# Altium schematic sheet power.SchDoc
size 584 x 279 mm
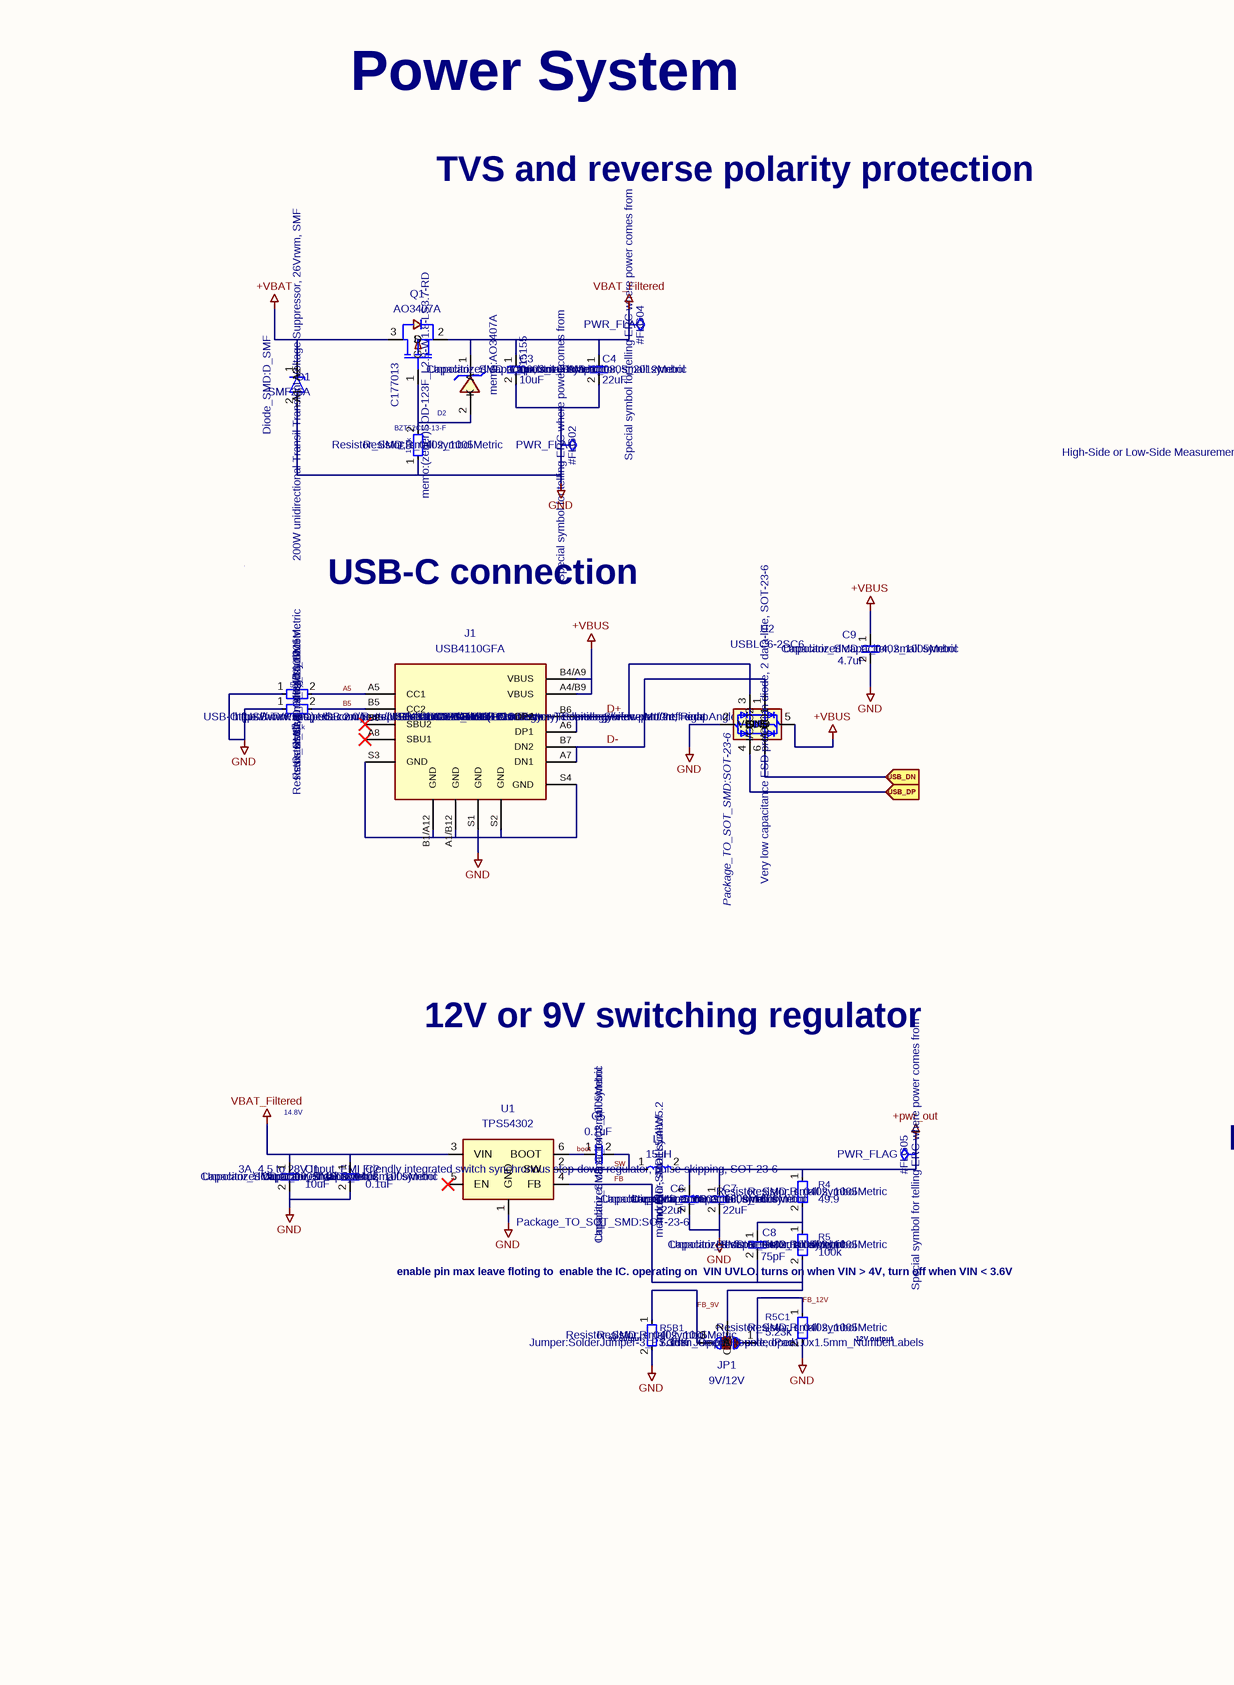
[diagram p0: power.SchDoc, left]
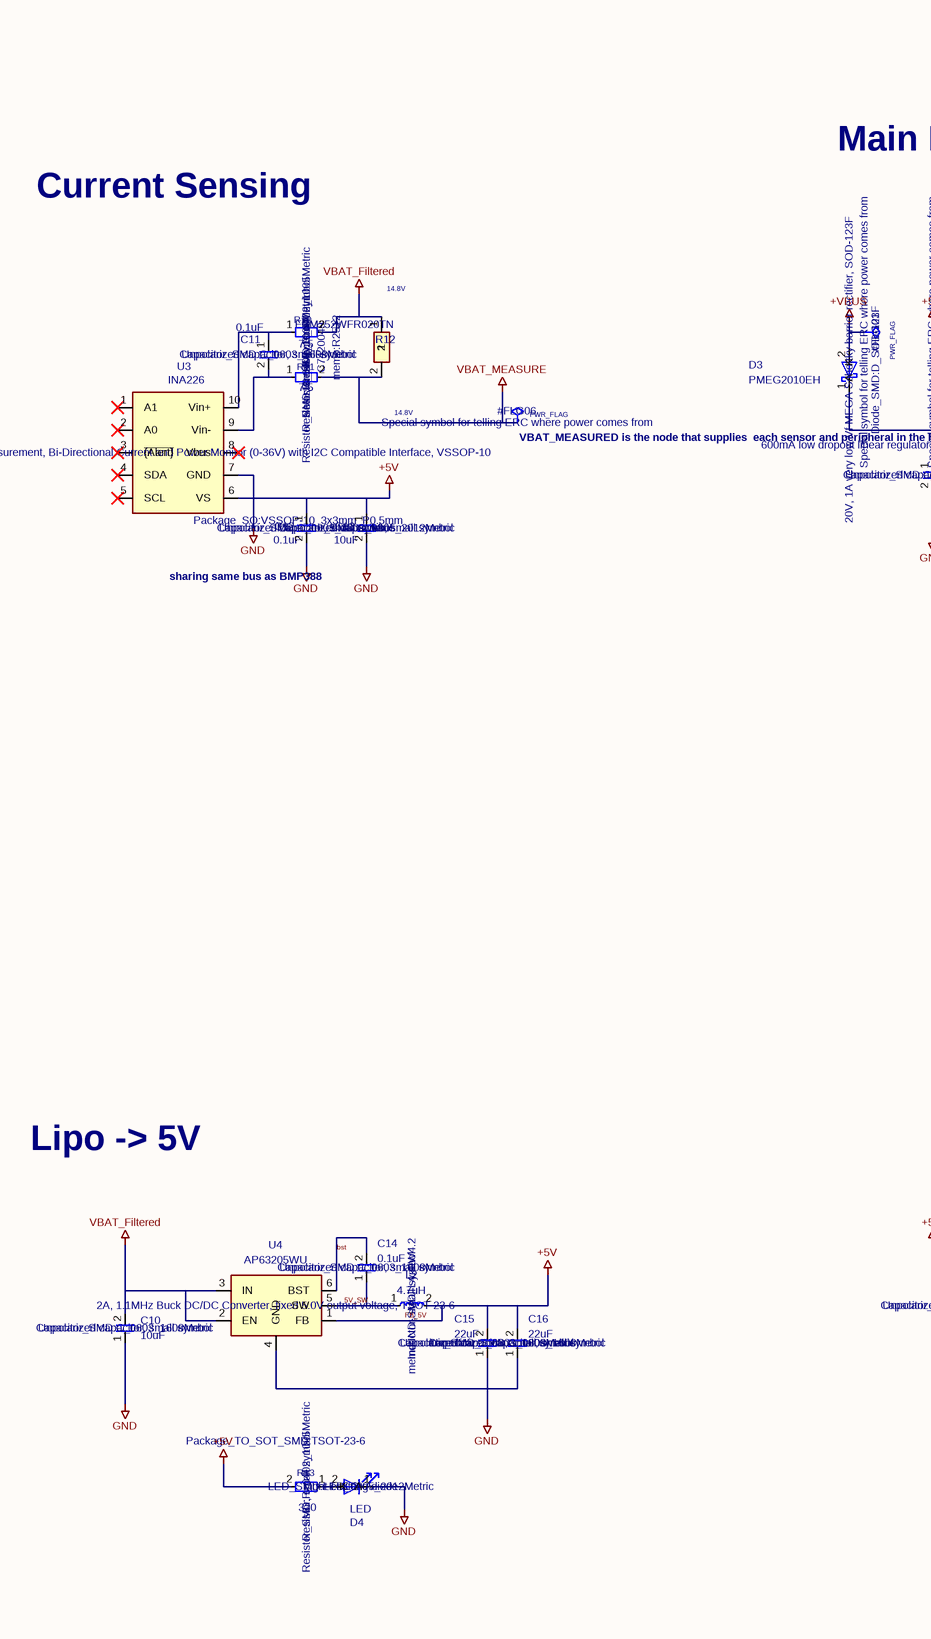
[diagram p1: power.SchDoc, middle]
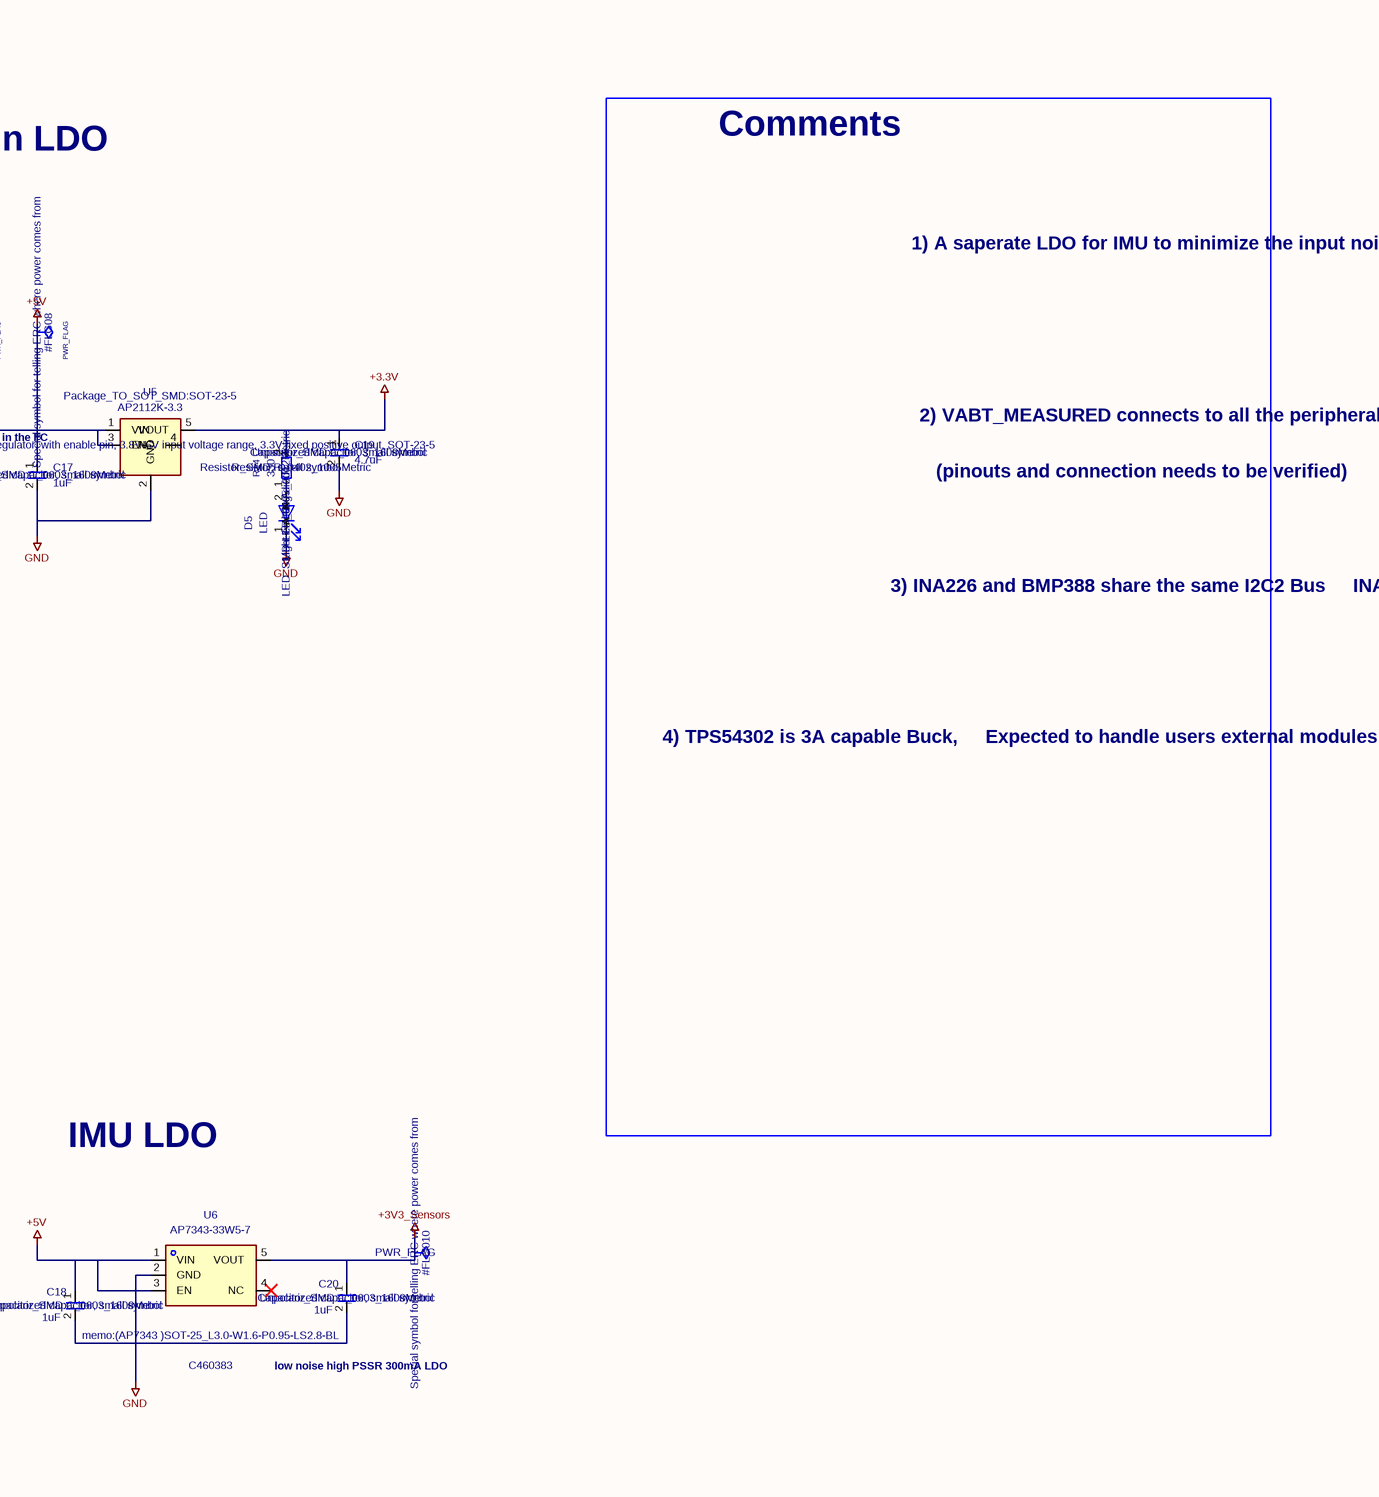
[diagram p2: power.SchDoc, right]

## Parts
#FLG01  Description: Special symbol for telling ERC where power comes from  (hidden comment: PWR_FLAG)  (graphical)
#FLG02  Description: Special symbol for telling ERC where power comes from  (hidden comment: PWR_FLAG)  (graphical)
#FLG04  Description: Special symbol for telling ERC where power comes from  (hidden comment: PWR_FLAG)  (graphical)
#FLG05  Description: Special symbol for telling ERC where power comes from  (hidden comment: PWR_FLAG)  (graphical)
#FLG06  Description: Special symbol for telling ERC where power comes from  (hidden comment: PWR_FLAG)  (graphical)
#FLG08  Description: Special symbol for telling ERC where power comes from  (hidden comment: PWR_FLAG)  (graphical)
#FLG010  Description: Special symbol for telling ERC where power comes from  (hidden comment: PWR_FLAG)  (graphical)
C1  Description: Unpolarized capacitor, small symbol  Footprint: Capacitor_SMD:C_0603_1608Metric  [C_0603_1608Metric]  (hidden comment: 10uF)
C2  Description: Unpolarized capacitor, small symbol  Footprint: Capacitor_SMD:C_0402_1005Metric  [C_0402_1005Metric]  (hidden comment: 0.1uF)
C3  Description: Unpolarized capacitor, small symbol  Footprint: Capacitor_SMD:C_0603_1608Metric  [C_0603_1608Metric]  (hidden comment: 10uF)
C4  Description: Unpolarized capacitor, small symbol  Footprint: Capacitor_SMD:C_0805_2012Metric  [C_0805_2012Metric]  (hidden comment: 22uF)
C5  Description: Unpolarized capacitor, small symbol  Footprint: Capacitor_SMD:C_0402_1005Metric  [C_0402_1005Metric]  (hidden comment: 0.1uF)
C6  Description: Unpolarized capacitor, small symbol  Footprint: Capacitor_SMD:C_0603_1608Metric  [C_0603_1608Metric]  (hidden comment: 22uF)
C7  Description: Unpolarized capacitor, small symbol  Footprint: Capacitor_SMD:C_0603_1608Metric  [C_0603_1608Metric]  (hidden comment: 22uF)
C8  Description: Unpolarized capacitor, small symbol  Footprint: Capacitor_SMD:C_0402_1005Metric  [C_0402_1005Metric]  (hidden comment: 75pF)
C9  Description: Unpolarized capacitor, small symbol  Footprint: Capacitor_SMD:C_0402_1005Metric  [C_0402_1005Metric]  (hidden comment: 4.7uF)
C10  Description: Unpolarized capacitor, small symbol  Footprint: Capacitor_SMD:C_0603_1608Metric  [C_0603_1608Metric]  (hidden comment: 10uF)
C11  Description: Unpolarized capacitor, small symbol  Footprint: Capacitor_SMD:C_0603_1608Metric  [C_0603_1608Metric]  (hidden comment: 0.1uF)
C12  Description: Unpolarized capacitor, small symbol  Footprint: Capacitor_SMD:C_0603_1608Metric  [C_0603_1608Metric]  (hidden comment: 0.1uF)
C13  Description: Unpolarized capacitor, small symbol  Footprint: Capacitor_SMD:C_0805_2012Metric  [C_0805_2012Metric]  (hidden comment: 10uF)
C14  Description: Unpolarized capacitor, small symbol  Footprint: Capacitor_SMD:C_0603_1608Metric  [C_0603_1608Metric]  (hidden comment: 0.1uF)
C15  Description: Unpolarized capacitor, small symbol  Footprint: Capacitor_SMD:C_0603_1608Metric  [C_0603_1608Metric]  (hidden comment: 22uF)
C16  Description: Unpolarized capacitor, small symbol  Footprint: Capacitor_SMD:C_0603_1608Metric  [C_0603_1608Metric]  (hidden comment: 22uF)
C17  Description: Unpolarized capacitor, small symbol  Footprint: Capacitor_SMD:C_0603_1608Metric  [C_0603_1608Metric]  (hidden comment: 1uF)
C18  Description: Unpolarized capacitor, small symbol  Footprint: Capacitor_SMD:C_0603_1608Metric  [C_0603_1608Metric]  (hidden comment: 1uF)
C19  Description: Unpolarized capacitor, small symbol  Footprint: Capacitor_SMD:C_0603_1608Metric  [C_0603_1608Metric]  (hidden comment: 4.7uF)
C20  Description: Unpolarized capacitor, small symbol  Footprint: Capacitor_SMD:C_0603_1608Metric  [C_0603_1608Metric]  (hidden comment: 1uF)
D1  Description: 200W unidirectional Transil Transient Voltage Suppressor, 26Vrwm, SMF  Footprint: Diode_SMD:D_SMF  [D_SMF]  (hidden comment: SMF26A)
D2  LCSC Part: C177013  Footprint: memo:(zener)SOD-123F_L2.8-W1.8-LS3.7-RD  [(zener)SOD-123F_L2.8-W1.8-LS3.7-RD]  (hidden comment: BZT52C12-13-F)
D3  Description: 20V, 1A very low Vf MEGA Schottky barrier rectifier, SOD-123F  Footprint: Diode_SMD:D_SOD-123F  [D_SOD-123F]  (hidden comment: PMEG2010EH)
D4  Description: Light emitting diode  Sim.Pins: 1=K 2=A  Footprint: LED_SMD:LED_0805_2012Metric  [LED_0805_2012Metric]  (hidden comment: LED)
D5  Description: Light emitting diode  Sim.Pins: 1=K 2=A  Footprint: LED_SMD:LED_0805_2012Metric  [LED_0805_2012Metric]  (hidden comment: LED)
J1  MF: Global Connector Technology  Description_1: USB-C (USB TYPE-C) USB 2.0 Receptacle Connector 24 (16+8 Dummy) Position Surface Mount, Right Angle  Package: None  Availability: In Stock  Footprint: memo:GCT_USB4110GFA  [GCT_USB4110GFA]  (hidden comment: USB4110GFA)
JP1  Description: Solder Jumper, 3-pole, open  Footprint: Jumper:SolderJumper-3_P1.3mm_Open_RoundedPad1.0x1.5mm_NumberLabels  [SolderJumper-3_P1.3mm_Open_RoundedPad1.0x1.5mm_NumberLabels]  (hidden comment: 9V/12V)
L1  Description: Inductor, small symbol  Footprint: memo:IND-SMD_L5.4-W5.2  [IND-SMD_L5.4-W5.2]  (hidden comment: 15uH)
L2  Description: Inductor, small symbol  Footprint: memo:IND-SMD_L4.4-W4.2  [IND-SMD_L4.4-W4.2]  (hidden comment: 4.7uH)
Q1  LCSC Part: C15155  Footprint: memo:AO3407A  [AO3407A]  (hidden comment: AO3407A)
R1  Description: Resistor, small symbol  Footprint: Resistor_SMD:R_0402_1005Metric  [R_0402_1005Metric]  (hidden comment: 5.1k)
R2  Description: Resistor, small symbol  Footprint: Resistor_SMD:R_0402_1005Metric  [R_0402_1005Metric]  (hidden comment: 5.1k)
R3  Description: Resistor, small symbol  Footprint: Resistor_SMD:R_0402_1005Metric  [R_0402_1005Metric]  (hidden comment: 100k)
R4  Description: Resistor, small symbol  Footprint: Resistor_SMD:R_0402_1005Metric  [R_0402_1005Metric]  (hidden comment: 49.9)
R5  Description: Resistor, small symbol  Footprint: Resistor_SMD:R_0402_1005Metric  [R_0402_1005Metric]  (hidden comment: 100k)
R5B1  Description: Resistor, small symbol  Footprint: Resistor_SMD:R_0402_1005Metric  [R_0402_1005Metric]  (hidden comment: 7.15K)
R5C1  Description: Resistor, small symbol  Footprint: Resistor_SMD:R_0402_1005Metric  [R_0402_1005Metric]  (hidden comment: 5.23k)
R10  Description: Resistor, small symbol  Footprint: Resistor_SMD:R_0402_1005Metric  [R_0402_1005Metric]  (hidden comment: 7.5)
R11  Description: Resistor, small symbol  Footprint: Resistor_SMD:R_0402_1005Metric  [R_0402_1005Metric]  (hidden comment: 7.5)
R12  LCSC Part: C7420049  Footprint: memo:R2512  [R2512]  (hidden comment: FRM252WFR020TN)
R13  Description: Resistor, small symbol  Footprint: Resistor_SMD:R_0402_1005Metric  [R_0402_1005Metric]  (hidden comment: 330)
R14  Description: Resistor, small symbol  Footprint: Resistor_SMD:R_0402_1005Metric  [R_0402_1005Metric]  (hidden comment: 330)
U1  Description: 3A, 4.5 to 28V Input, EMI Friendly integrated switch synchronous step-down regulator, pulse-skipping, SOT-23-6  Footprint: Package_TO_SOT_SMD:SOT-23-6  [SOT-23-6]  (hidden comment: TPS54302)
U2  Description: Very low capacitance ESD protection diode, 2 data-line, SOT-23-6  Footprint: Package_TO_SOT_SMD:SOT-23-6  [SOT-23-6]  (hidden comment: USBLC6-2SC6)
U3  Description: High-Side or Low-Side Measurement, Bi-Directional Current and Power Monitor (0-36V) with I2C Compatible Interface, VSSOP-10  Footprint: Package_SO:VSSOP-10_3x3mm_P0.5mm  [VSSOP-10_3x3mm_P0.5mm]  (hidden comment: INA226)
U4  Description: 2A, 1.1MHz Buck DC/DC Converter, fixed 5.0V output voltage, TSOT-23-6  Footprint: Package_TO_SOT_SMD:TSOT-23-6  [TSOT-23-6]  (hidden comment: AP63205WU)
U5  Description: 600mA low dropout linear regulator, with enable pin, 3.8V-6V input voltage range, 3.3V fixed positive output, SOT-23-5  Footprint: Package_TO_SOT_SMD:SOT-23-5  [SOT-23-5]  (hidden comment: AP2112K-3.3)
U6  LCSC Part: C460383  Footprint: memo:(AP7343 )SOT-25_L3.0-W1.6-P0.95-LS2.8-BL  [(AP7343 )SOT-25_L3.0-W1.6-P0.95-LS2.8-BL]  (hidden comment: AP7343-33W5-7)

## Ports
USB_DN (in), USB_DP (in)

## Nets
+3.3V: C19.1 R14.2 U5.5(VOUT)
+3V3_Sensors: #FLG010.1 C20.1 U6.5(VOUT)
+pwr_out: #FLG05.1 C6.1 C7.1 L1.2 R4.1
+VBAT: D1.1(A1) Q1.3(D)
+VBUS: #FLG01.1 C9.1 D3.2(A) J1.A4/B9(VBUS) J1.B4/A9(VBUS) U2.5(VBUS)
FB_5V: #FLG08.1 C12.1 C13.1 C15.2 C16.2 C17.1 C18.1 D3.1(K) L2.2 R13.2 U3.6(VS) U4.1(FB) U5.1(VIN) U5.3(EN) U6.1(VIN) U6.3(EN)  [also labelled +5V]
GND: #FLG02.1 C1.2 C2.2 C3.2 C4.2 C6.2 C7.2 C9.2 C10.1 C12.2 C13.2 C15.1 C16.1 C17.2 C18.2 C19.2 C20.2 D1.2(A2) D4.1(K) D5.1(K) J1.A1/B12(GND) J1.B1/A12(GND) J1.S1(GND) J1.S2(GND) J1.S3(GND) J1.S4(GND) R1.1 R2.1 R3.1 R5B1.2 R5C1.2 U1.1(GND) U2.2(GND) U3.7(GND) U4.4(GND) U5.2(GND) U6.2(GND)
VBAT_Filtered: #FLG04.1 C1.1 C2.1 C3.1 C4.1 C10.2 D2.1(K) Q1.2(S) R10.2 R12.1 U1.3(VIN) U4.2(EN) U4.3(IN)
VBAT_MEASURE: #FLG06.1 R11.2 R12.2
5V_SW: C14.1 L2.1 U4.5(SW)
A5: J1.A5(CC1) R1.2
B5: J1.B5(CC2) R2.2
boot: C5.1 U1.6(BOOT)
bst: C14.2 U4.6(BST)
D+: J1.A6(DP1) J1.B6(DP2) U2.3(I/O2)
D-: J1.A7(DN1) J1.B7(DN2) U2.1(I/O1)
FB: C8.2 JP1.2(C) R5.2 U1.4(FB)
FB_9V: JP1.3(B) R5B1.1
FB_12V: JP1.1(A) R5C1.1
SW: C5.2 L1.1 U1.2(SW)
USB_DN: U2.6(I/O1) ; port USB_DN
USB_DP: U2.4(I/O2) ; port USB_DP
NetC8_1: C8.1 R4.2 R5.1
NetC11_1: C11.1 R10.1 U3.10(Vin+)
NetC11_2: C11.2 R11.1 U3.9(Vin-)
NetD2_2: D2.2(A) Q1.1(G) R3.2
NetD4_2: D4.2(A) R13.1
NetD5_2: D5.2(A) R14.1

Not connected (* = marked no-connect by the designer): J1 A8(SBU1)* B8(SBU2)*; U1 5(EN)*; U3 1(A1)* 2(A0)* 3(~{{Alert}})* 4(SDA)* 5(SCL)* 8(Vbus)*; U5 4(NC); U6 4(NC)*

## Notes on the sheet
- Power System
- Main LDO
- Comments
- TVS and reverse polarity protection
- Current Sensing
- (near R12) 14.8V
- 1) A saperate LDO for IMU to minimize the input noise
  per multiple firmwares advise.
- (near #FLG06) VBAT_MEASURED is the node that supplies
  each sensor and peripheral in the FC
- 2) VABT_MEASURED connects to all the peripherals on the
  FC and is able to measure Current and Voltage over I2C
  eliminating the need for ADC pins on mcu.
- (pinouts and connection needs to be verified)
- USB-C connection
- (near C12) sharing same bus as BMP388
- 3) INA226 and BMP388 share the same I2C2 Bus
  INA226 Address : 0X40 A0, A1 -> GND
  BMP388 Address : 0X76  SDO -> GND
- 4) TPS54302 is 3A capable Buck,
  Expected to handle users external modules
  attachements. DJI Air Unit, Analog VTX, etc...
- 12V or 9V switching regulator
- 14.8V
- Lipo -> 5V
- IMU LDO
- enable pin max leave floting to
  enable the IC. operating on
  VIN UVLO. turns on when VIN
  > 4V, turn off when VIN < 3.6V
- (near R5B1) 9V output
- (near R5C1) 12V output
- low noise high PSSR 300mA LDO
- 1
- 2
- 3
- 4
- 5
- 6
- 7
- 8
- 9
- 10
- 11
- A
- B
- C
- D
- E
- Title:
- File: power.kicad_sch
- Sheet: /
- KiCad E.D.A.  kicad (5.1.4)-1
- Size: User
- Date:
- Rev:
- Id: 1/1

## Library data of the parts
C1-C20 = C_Small
  C1 C3 C10 C13: Value: 10uF
  C2 C5 C11 C12 C14: Value: 0.1uF
  C4 C6 C7 C15 C16: Value: 22uF
  C8: Value: 75pF
  C9 C19: Value: 4.7uF
  C17 C18 C20: Value: 1uF
JP1 = SolderJumper_3_Open: Value: 9V/12V
L1 L2 = L_Small
  L1: Value: 15uH
  L2: Value: 4.7uH
R1-R5 R5B1 R5C1 R10 R11 R13 R14 = R_Small
  R1 R2: Value: 5.1k
  R3 R5: Value: 100k
  R4: Value: 49.9
  R5B1: Value: 7.15K
  R5C1: Value: 5.23k
  R10 R11: Value: 7.5
  R13 R14: Value: 330
#FLG01 #FLG02 #FLG04 #FLG05 #FLG06 #FLG08 #FLG010 = PWR_FLAG: Value: PWR_FLAG
D1 = SMF26A: Value: SMF26A
D2 = BZT52C12-13-F: Value: BZT52C12-13-F
D3 = PMEG2010EH: Value: PMEG2010EH
D4 D5 = LED: Value: LED
J1 = USB4110GFA: Price: None; SnapEDA_Link: https://www.snapeda.com/parts/USB4110GFA/Global+Connector+Technology/view-part/?ref=snap; MP: USB4110GFA; Check_prices: https://www.snapeda.com/parts/USB4110GFA/Global+Connector+Technology/view-part/?ref=eda; Value: USB4110GFA
Q1 = AO3407A: Value: AO3407A
R12 = FRM252WFR020TN: Value: FRM252WFR020TN
U1 = TPS54302: Value: TPS54302
U2 = USBLC6-2SC6: Value: USBLC6-2SC6
U3 = INA226: Value: INA226
U4 = AP63205WU: Value: AP63205WU
U5 = AP2112K-3.3: Value: AP2112K-3.3
U6 = AP7343-33W5-7: Value: AP7343-33W5-7